# EAGLE schematic Steering Wheel ECU with Teensy (EAGLE 7.7.0)
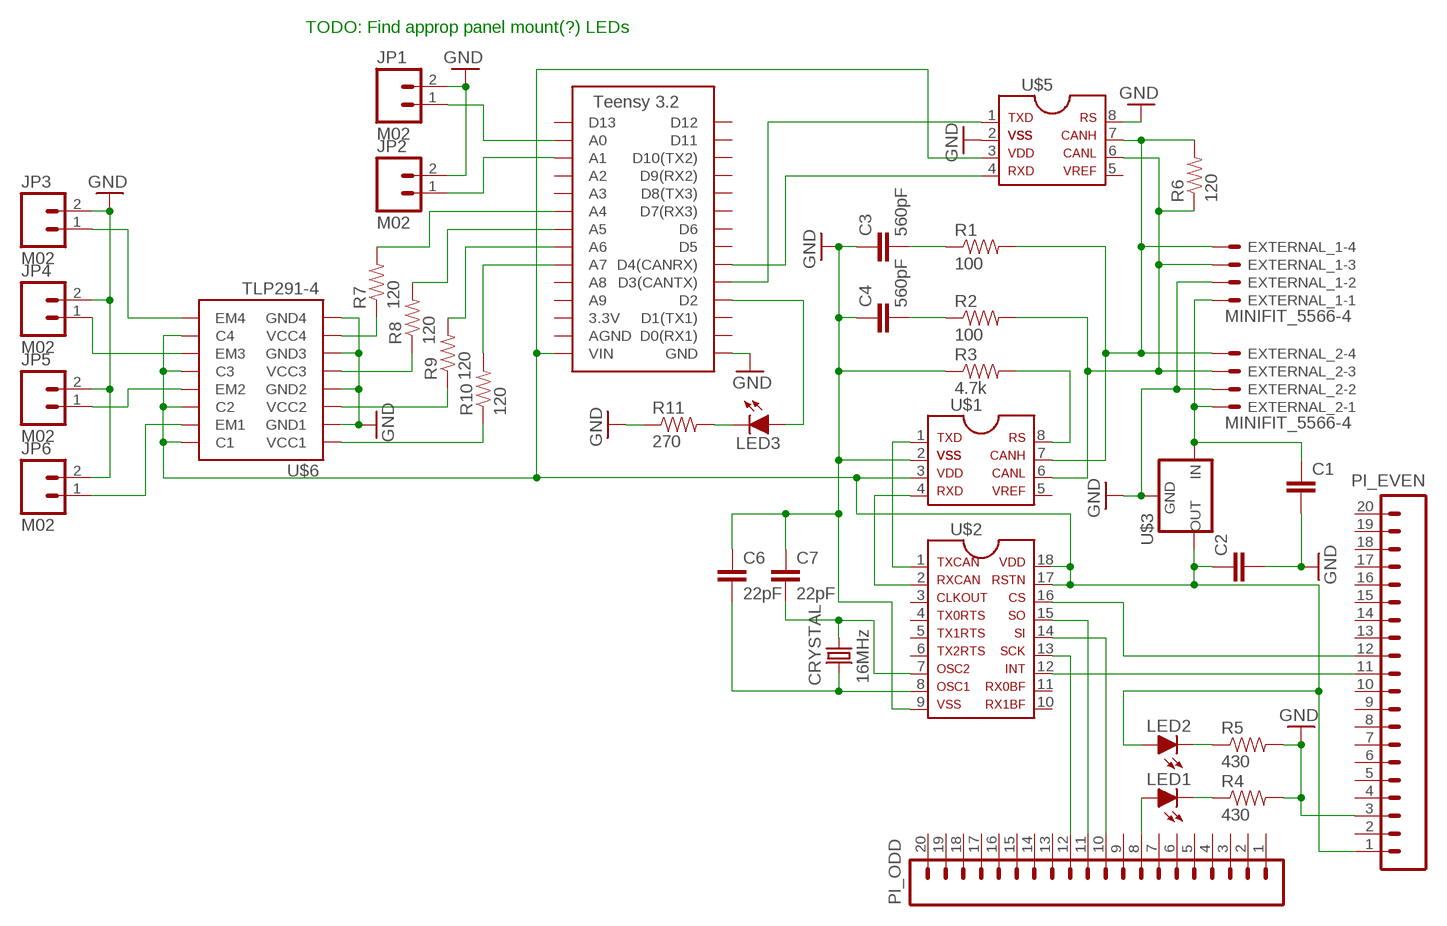
[diagram p0: schematic, sheet 1]

## Parts
C1  CAP0805  [0805]
C2  CAP0805  [0805]
C3  560pF  CAP0805  [0805]
C4  560pF  CAP0805  [0805]
C6  22pF  CAP0805  [0805]
C7  22pF  CAP0805  [0805]
CRYSTAL  16MHz  CRYSTALSMD  [HC49UP]
EXTERNAL_1  MINIFIT_5566-4  [MINIFIT_5566-4]
EXTERNAL_2  MINIFIT_5566-4  [MINIFIT_5566-4]
JP1  M02  [1X02]
JP2  M02  [1X02]
JP3  M02  [1X02]
JP4  M02  [1X02]
JP5  M02  [1X02]
JP6  M02  [1X02]
LED1  LED-0805  [LED-805]
LED2  LED-0805  [LED-805]
LED3  LED-0805  [LED-805]
PI_EVEN  M20  [1X20]
PI_ODD  M20  [1X20]
R1  100  RESISTOR0805-RES  [0805]
R2  100  RESISTOR0805-RES  [0805]
R3  4.7k  RESISTOR0805-RES  [0805]
R4  430  RESISTOR0805-RES  [0805]
R5  430  RESISTOR0805-RES  [0805]
R6  120  RESISTOR0805-RES  [0805]
R7  120  RESISTOR0805-RES  [0805]
R8  120  RESISTOR0805-RES  [0805]
R9  120  RESISTOR0805-RES  [0805]
R10  120  RESISTOR0805-RES  [0805]
R11  270  RESISTOR0805-RES  [0805]
U$1  MCP2551  [SOIC-08]
U$2  MCP2515SMD  [SOIC-18W]
U$3  5VREG_L7805_HOR  [TO-220-H]
U$4  TEENSY_3.2_SIMPLE  [TEENSY_3.2_SIMPLE]
U$5  MCP2551  [SOIC-08]
U$6  TLP291-4  [SOIC-16]

## Nets
5VSUPPLY: C2.1 LED2.A PI_EVEN.1 U$1.3 U$2.17 U$2.18 U$3.3(OUT) U$4.VIN U$5.3 U$6.10(C4) U$6.12(C3) U$6.14(C2) U$6.16(C1)
CAN-H: EXTERNAL_1.4 EXTERNAL_2.4 R1.2 R6.2 U$1.7 U$5.7
CAN-L: EXTERNAL_1.3 EXTERNAL_2.3 R2.2 R6.1 U$1.6 U$5.6
CS: PI_EVEN.12 U$2.16
GND: C1.2 C2.2 C3.1 C4.1 C6.1 C7.1 EXTERNAL_1.2 EXTERNAL_2.2 JP1.2 JP2.2 JP3.2 JP4.2 JP5.2 JP6.2 PI_EVEN.3 R3.1 R4.2 R5.2 R11.1 U$1.2 U$2.9 U$3.2(GND) U$4.GND U$5.2 U$5.8 U$6.2(GND1) U$6.4(GND2) U$6.6(GND3) U$6.8(GND4)
INT: PI_EVEN.11 U$2.12
N$1: LED1.C R4.1
N$2: PI_ODD.11 U$2.15
N$3: PI_ODD.10 U$2.14
N$4: PI_ODD.12 U$2.13
N$5: C1.1 EXTERNAL_1.1 EXTERNAL_2.1 U$3.1(IN)
N$6: LED1.A PI_ODD.8
N$7: LED2.C R5.1
N$8: U$4.D3(CANTX) U$5.1
N$9: U$4.D4(CANRX) U$5.4
N$10: JP1.1 U$4.A0
N$11: C6.2 CRYSTAL.2 U$2.8
N$12: U$1.1 U$2.1
N$13: U$1.4 U$2.2
N$14: C3.2 R1.1
N$15: C7.2 CRYSTAL.1 U$2.7
N$16: R3.2 U$1.8
N$17: C4.2 R2.1
N$18: JP2.1 U$4.A1
N$19: R7.1 U$6.7(VCC4)
N$20: LED3.C R11.2
N$21: R7.2 U$4.A4
N$22: JP3.1 U$6.9(EM4)
N$23: JP4.1 U$6.11(EM3)
N$24: R8.2 U$4.A5
N$25: JP5.1 U$6.13(EM2)
N$26: JP6.1 U$6.15(EM1)
N$27: R9.2 U$4.A6
N$28: R10.2 U$4.A7
N$29: R8.1 U$6.5(VCC3)
N$30: R9.1 U$6.3(VCC2)
N$31: R10.1 U$6.1(VCC1)
N$32: LED3.A U$4.D2
Unconnected: PI_EVEN.2 PI_EVEN.4 PI_EVEN.5 PI_EVEN.6 PI_EVEN.7 PI_EVEN.8 PI_EVEN.9 PI_EVEN.10 PI_EVEN.13 PI_EVEN.14 PI_EVEN.15 PI_EVEN.16 PI_EVEN.17 PI_EVEN.18 PI_EVEN.19 PI_EVEN.20 PI_ODD.1 PI_ODD.2 PI_ODD.3 PI_ODD.4 PI_ODD.5 PI_ODD.6 PI_ODD.7 PI_ODD.9 PI_ODD.13 PI_ODD.14 PI_ODD.15 PI_ODD.16 PI_ODD.17 PI_ODD.18 PI_ODD.19 PI_ODD.20 U$1.5 U$2.3 U$2.4 U$2.5 U$2.6 U$2.10 U$2.11 U$4.3.3V U$4.A2 U$4.A3 U$4.A8 U$4.A9 U$4.AGND U$4.D0(RX1) U$4.D1(TX1) U$4.D5 U$4.D6 U$4.D7(RX3) U$4.D8(TX3) U$4.D9(RX2) U$4.D10(TX2) U$4.D11 U$4.D12 U$4.D13 U$5.5

## Notes on the sheet
- TODO: Find approp panel mount(?) LEDs

## Library data of the parts
C1-C4 C6 C7 = HyTechDevices:CAP: Capacitor Standard 0603 ceramic capacitor, and 0.1" leaded capacitor.
CRYSTAL = SparkFun-FreqCtrl:CRYSTAL: Various standard crystals. Proven footprints.
EXTERNAL_1 EXTERNAL_2 = HyTechDevices:MINIFIT_5566-4: Mini-Fit Junior connector 4 pole Source: http://www.molex.com; OC_FARNELL: unknown; OC_NEWARK: unknown
JP1-JP6 = HyTechDevices:M02: Standard 2-pin 0.1" header. NOTES ON THE VARIANTS LOCK and LOCK_LONGPADS... This footprint was designed to help hold the alignment of a through-hole component (i.e. 6-pin header) while soldering it into place. You may notice that each hole has been shifted either up or down by 0.005 of an inch from it's more standard position (which is a perfectly straight line). This slight alteration caused the pins (the squares in the middle) to touch the edges of the holes. Because they are alternating, it causes a "brace" to hold the component in place. 0.005 has proven to be the perfect amount of "off-center" position when using our standard breakaway headers. Although looks a little odd when you look at the bare footprint, once you have a header in there, the alteration is very hard to notice. Also,if you push a header all the way into place, it is covered up entirely on the bottom side. This idea of altering the position of holes to aid alignment will be further integrated into the Sparkfun Library for other footprints. It can help hold any component with 3 or more connection pins. Note: The Sparkfun version includes many other packages including surface mount that may be of future interest. Source: Sparkfun <https://github.com/sparkfun/SparkFun-Eagle-Libraries>
LED1-LED3 = HyTechDevices:LED: Light Emitting Diode (LED) Source: Dangerous Prototypes Eagle Library <https://github.com/DangerousPrototypes/Eagle_Part_Library>
PI_EVEN PI_ODD = HyTechDevices:M20: 1x20 .1" header This is just like the LOCK variant in that the holes are staggared by 5 mil, but except for the last two holes. They are not altered from the "standard" footprint layout. This is used for a special purpose on the layout of our Graphic LCD Backpack. Make sure you want to use this device before selecting it for you project! Source: Sparkfun <https://github.com/sparkfun/SparkFun-Eagle-Libraries>
R1-R11 = HyTechDevices:RESISTOR: Resistor Basic schematic elements and footprints for 0603, 1206, and PTH resistors.
U$1 U$5 = HyTechDevices:MCP2551: MCP2551 High-Speed CAN Transceiver Product Webpage <https://www.microchip.com/wwwproducts/en/MCP2551> Datasheet <http://ww1.microchip.com/downloads/en/DeviceDoc/21667f.pdf> This device is outdated It is replaced by MCP2561. Comparison Page <https://www.microchip.com/wwwproducts/ProductCompare/MCP2551/MCP2561> Product Webpage <https://www.microchip.com/wwwproducts/en/MCP2561> Datasheet <http://ww1.microchip.com/downloads/en/DeviceDoc/20005167C.pdf>
U$2 = HyTechDevices:MCP2515: MCP2515 CAN Controller with SPI Interface Datasheet <http://ww1.microchip.com/downloads/en/DeviceDoc/21801G.pdf>
U$3 = HyTechDevices:5VREG_L7805: Voltage Regulator Switching 5v regulator Datasheet <http://power.murata.com/data/power/oki-78sr.pdf> Standard 7805 5V regulator. IGO (Input Ground Output). Spark Fun Electronics SKU : COM-00107 Datasheet <http://www.mouser.com/ds/2/308/MC7800-D-94905.pdf>
U$4 = HyTechDevices:TEENSY_3.2_SIMPLE: Simple version of the Teensy 3.2 board that only uses the 2 main rows of pins, not the inner pins or the pins opposite the usb port.
U$6 = HyTechDevices:TLP291-4: Toshiba Quad Channel Optocoupler TLP291-4